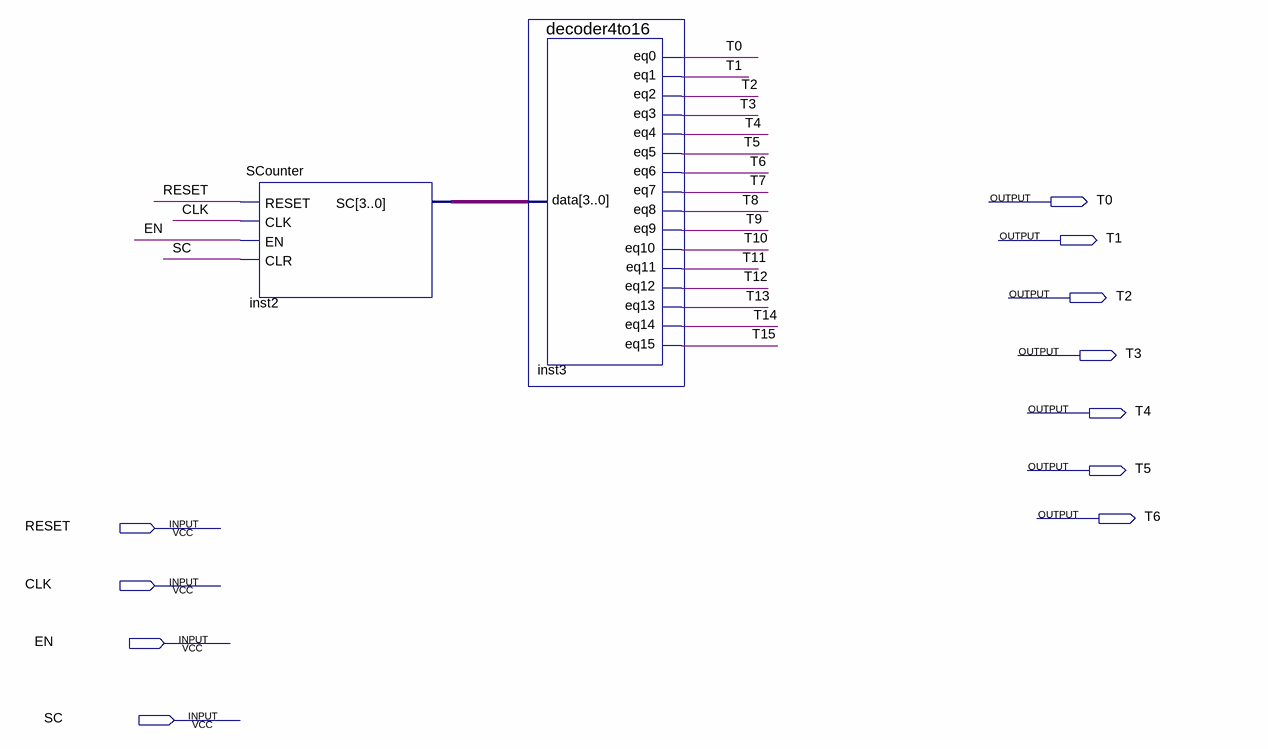
[diagram p0: schematic sheet]
// Quartus schematic TEST.bdf as structural Verilog: 2 symbols, 11 pins
module TEST (
  input  RESET,
  input  CLK,
  input  EN,
  input  SC,
  output T0,
  output T1,
  output T2,
  output T3,
  output T4,
  output T5,
  output T6
);

  wire T7, T8, T9, T10, T11, T12, T13, T14, T15;
  wire [3:0] inst2_sc;

  SCounter inst2 (.RESET(RESET), .CLK(CLK), .EN(EN), .CLR(SC), .SC(inst2_sc));
  decoder4to16 inst3 (
    .data(inst2_sc), .eq0(T0), .eq1(T1), .eq2(T2), .eq3(T3), .eq4(T4), .eq5(T5), .eq6(T6), .eq7(T7),
    .eq8(T8), .eq9(T9), .eq10(T10), .eq11(T11), .eq12(T12), .eq13(T13), .eq14(T14), .eq15(T15));
endmodule
